# Altium project BLDC_DRV_F1.PrjPcb
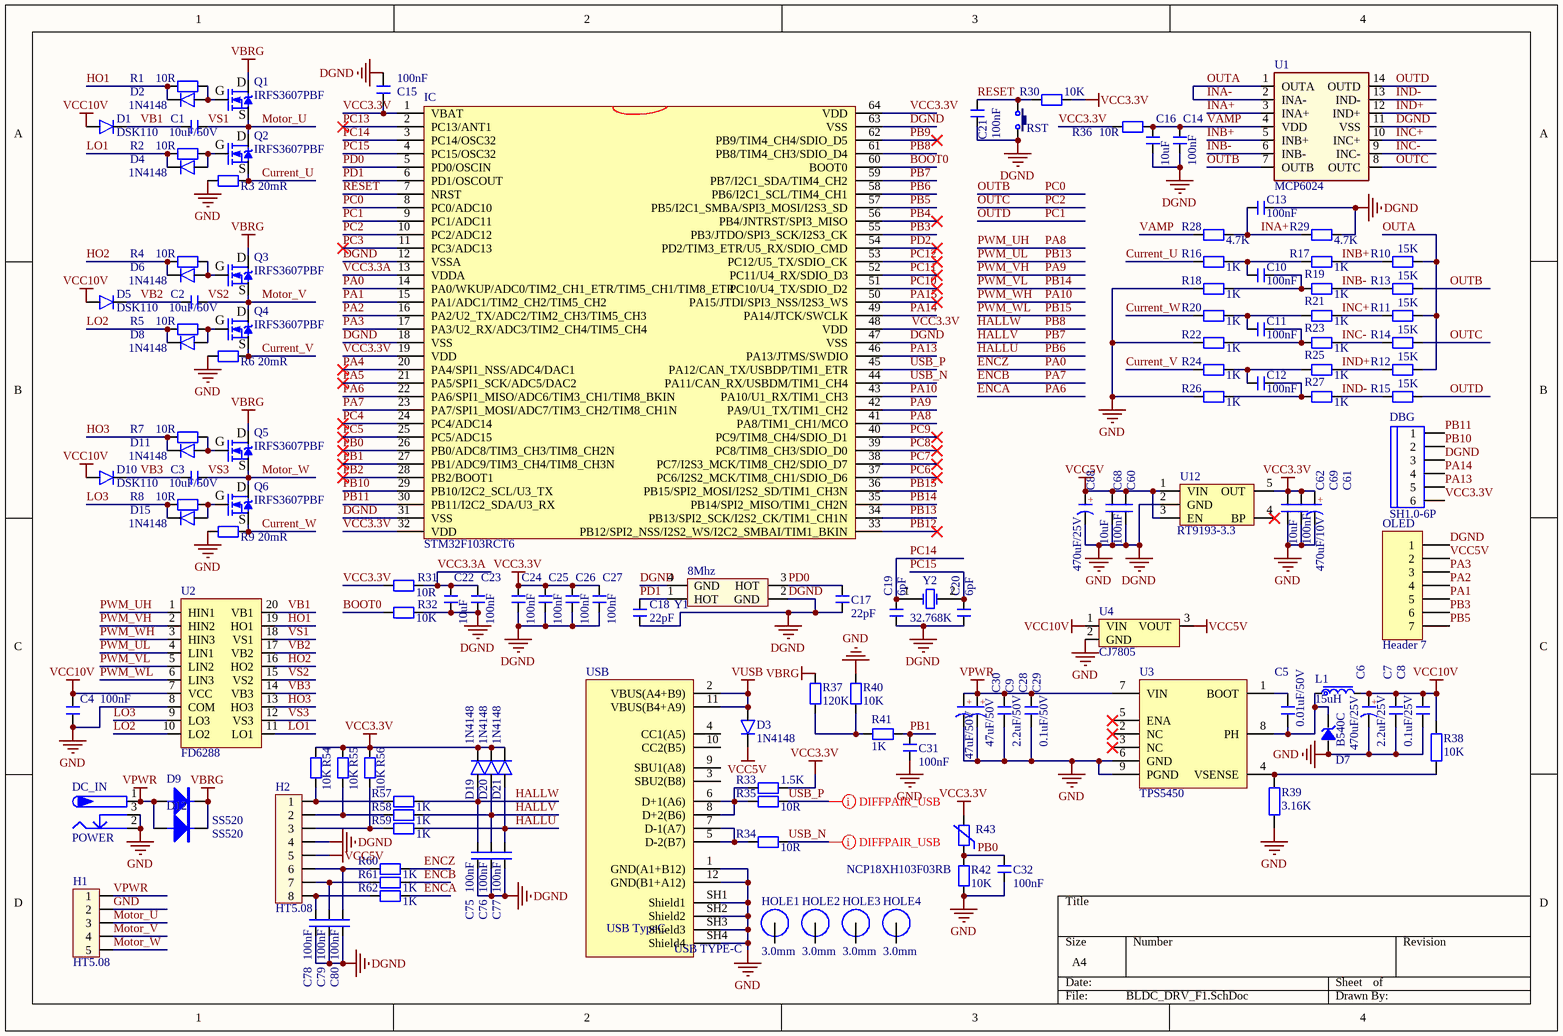
[diagram p0: BLDC_DRV_F1.SchDoc]
1 sheet, 138 parts. Net scope: global (net labels, ports and power ports of the same name join across sheets).
Board file: BLDC_DRV_F1.PcbDoc

## Sheet BLDC_DRV_F1.SchDoc
size A4

### Parts
C1  10uF/50V  [C 0603_L]
C2  10uF/50V  [C 0603_L]
C3  10uF/50V  [C 0603_L]
C4  100nF  [C 0603_L]
C5  0.01uF/50V  [C 0805_L]
C6  470uF/25V  [CM D(6.3*7.7)]
C7  2.2uF/25V  [C 0603_L]
C8  0.1uF/25V  [C 0603_L]
C9  47uF/50V  [CM D(6.3*7.7)]
C10  100nF  [C 0603_L]
C11  100nF  [C 0603_L]
C12  100nF  [C 0603_L]
C13  100nF  [C 0603_L]
C14  100nF  [C 0603_L]
C15  100nF  [C 0603_L]
C16  10uF  [C 0603_L]
C17  22pF  [C 0603_L]
C18  22pF  [C 0603_L]
C19  6pF  [C 0603_L]
C20  6pF  [C 0603_L]
C21  100nF  [C 0603_L]
C22  10uF  [C 0603_L]
C23  100nF  [C 0603_L]
C24  100nF  [C 0603_L]
C25  100nF  [C 0603_L]
C26  100nF  [C 0603_L]
C27  100nF  [C 0603_L]
C28  2.2uF/50V  [C 0805_L]
C29  0.1uF/50V  [C 0805_L]
C30  47uF/50V  [CM D(6.3*7.7)]
C31  100nF  [C 0603_L]
C32  100nF  [C 0603_L]
C60  100nF  [C 0603_L]
C61  470uF/10V  [CM D(6.3*7.7)]
C62  10uF  [C 0603_L]
C68  10uF  [C 0603_L]
C69  100nF  [C 0603_L]
C75  100nF  [C 0603_L]
C76  100nF  [C 0603_L]
C77  100nF  [C 0603_L]
C78  100nF  [C 0603_L]
C79  100nF  [C 0603_L]
C80  100nF  [C 0603_L]
C88  470uF/25V  [CM D(6.3*7.7)]
D1  DSK110  [SOD-323]
D2  1N4148  [SOD-323]
D3  1N4148  [SOD-323]
D4  1N4148  [SOD-323]
D5  DSK110  [SOD-323]
D6  1N4148  [SOD-323]
D7  B540C  [SMB]
D8  1N4148  [SOD-323]
D9  SS520  [SMC]
D10  DSK110  [SOD-323]
D11  1N4148  [SOD-323]
D12  SS520  [SMC]
D15  1N4148  [SOD-323]
D19  1N4148  [SOD-323]
D20  1N4148  [SOD-323]
D21  1N4148  [SOD-323]
DBG  SH1.0-6P  [SH1.0_6P]
DC_IN  POWER  [DC10B]
H1  HT5.08  [KF7620-5P]
H2  HT5.08  [SH1.0 S-W-8P]
HOLE1  value 3.0mm  [M3]  (hidden comment: HOLE)
HOLE2  value 3.0mm  [M3]  (hidden comment: HOLE)
HOLE3  value 3.0mm  [M3]  (hidden comment: HOLE)
HOLE4  value 3.0mm  [M3]  (hidden comment: HOLE)
IC  STM32F103RCT6  [LQFP64-10*10]
L1  15uH  [CDRH73]
OLED  Header 7  [HDR2.54-M-LI-7P]
Q1  IRFS3607PBF  [TO263-3B]
Q2  IRFS3607PBF  [TO263-3B]
Q3  IRFS3607PBF  [TO263-3B]
Q4  IRFS3607PBF  [TO263-3B]
Q5  IRFS3607PBF  [TO263-3B]
Q6  IRFS3607PBF  [TO263-3B]
R1  10R  [R 0603_L]
R2  10R  [R 0603_L]
R3  20mR  [R 2512_L]
R4  10R  [R 0603_L]
R5  10R  [R 0603_L]
R6  20mR  [R 2512_L]
R7  10R  [R 0603_L]
R8  10R  [R 0603_L]
R9  20mR  [R 2512_L]
R10  15K  [R 0603_L]
R11  15K  [R 0603_L]
R12  15K  [R 0603_L]
R13  15K  [R 0603_L]
R14  15K  [R 0603_L]
R15  15K  [R 0603_L]
R16  1K  [R 0603_L]
R17  1K  [R 0603_L]
R18  1K  [R 0603_L]
R19  1K  [R 0603_L]
R20  1K  [R 0603_L]
R21  1K  [R 0603_L]
R22  1K  [R 0603_L]
R23  1K  [R 0603_L]
R24  1K  [R 0603_L]
R25  1K  [R 0603_L]
R26  1K  [R 0603_L]
R27  1K  [R 0603_L]
R28  4.7K  [R 0603_L]
R29  4.7K  [R 0603_L]
R30  10K  [R 0603_L]
R31  10R  [R 0603_L]
R32  10K  [R 0603_L]
R33  1.5K  [R 0603_L]
R34  10R  [R 0603_L]
R35  10R  [R 0603_L]
R36  10R  [R 0603_L]
R37  120K  [R 0603_L]
R38  10K  [R 0603_L]
R39  3.16K  [R 0603_L]
R40  10K  [R 0603_L]
R41  1K  [R 0603_L]
R42  10K  [R 0603_L]
R43  NCP18XH103F03RB  [R 0603_L]
R54  10K  [R 0603_L]
R55  10K  [R 0603_L]
R56  10K  [R 0603_L]
R57  1K  [R 0603_L]
R58  1K  [R 0603_L]
R59  1K  [R 0603_L]
R60  1K  [R 0603_L]
R61  1K  [R 0603_L]
R62  1K  [R 0603_L]
RST  KEY  [TSW SMD-3*6*2.5]  (value not drawn)
U1  MCP6024  [SOP14_L]
U2  FD6288  [TSSOP20_L]
U3  TPS5450  [SOP8_G]
U4  CJ7805  [TO263_3B]
U12  RT9193-3.3  [SOT23-5L]
USB  USB TypeC  [USB Type-C]
Y1  8Mhz  [XTAL-3225]
Y2  32.768K  [OSC 3215-2P]

### Nets
DGND: C4.1 C6.2(K) C7.1 C8.1 C9.2(K) C13.2 C14.2 C15.2 C16.2 C17.1 C18.1 C19.1 C20.1 C21.2 C22.2 C23.2 C24.2 C25.2 C26.2 C27.2 C28.1 C29.1 C30.2(K) C31.1 C32.1 C60.2 C61.2(K) C62.2 C68.2 C69.2 C75.2 C76.2 C77.2 C78.2 C79.2 C80.2 C88.2(K) D7.1 DBG.3 DC_IN.2 DC_IN.3 H1.2 H2.4 IC.12(VSSA) IC.18(VSS) IC.31(VSS) IC.47(VSS) IC.63(VSS) OLED.1 R3.1 R6.1 R9.1 R18.1 R22.1 R26.1 R29.2 R32.2 R39.1 R40.2 R42.1 RST.2 U1.11(VSS) U2.8(COM) U3.6(GND) U3.9(PGND) U4.2(GND) U12.2(GND) USB.1(GND(A1+B12)) USB.12(GND(B1+A12)) USB.SH1(Shield1) USB.SH2(Shield2) USB.SH3(Shield3) USB.SH4(Shield4) Y1.2(GND) Y1.4(GND)  [also labelled GND]
VBRG: D9.2(K) D12.2(K) Q1.2(D) Q3.2(D) Q5.2(D) R37.2
VCC3.3V: C15.1 C24.1 C25.1 C26.1 C27.1 C61.1(A) C62.1 C69.1 D19.2 D20.2 D21.2 DBG.6 IC.1(VBAT) IC.19(VDD) IC.32(VDD) IC.48(VDD) IC.64(VDD) R30.2 R31.1 R33.2 R36.1 R43.2 R54.2 R55.2 R56.2 U12.5(OUT)
VCC5V: C60.1 C68.1 C88.1(A) D3.2 H2.5 OLED.2 U4.3(VOUT) U12.1(VIN) U12.3(EN)
VCC10V: C4.2 C6.1(A) C7.2 C8.2 D1.1 D5.1 D10.1 L1.2 R38.1 U2.7(VCC) U4.1(VIN)
VPWR: C9.1(A) C28.2 C29.2 C30.1(A) D9.1(A) D12.1(A) DC_IN.1 H1.1 U3.7(VIN)
VUSB: D3.1 USB.2(VBUS(A4+B9)) USB.11(VBUS(B4+A9))
BOOT0: IC.60(BOOT0) R32.1
Current_U: Q2.3(S) R3.2 R16.1
Current_V: Q4.3(S) R6.2 R24.1
Current_W: Q6.3(S) R9.2 R20.1
ENCA: IC.22(PA6/SPI1_MISO/ADC6/TIM3_CH1/TIM8_BKIN) R62.2  [also labelled PA6]
ENCB: IC.23(PA7/SPI1_MOSI/ADC7/TIM3_CH2/TIM8_CH1N) R61.2  [also labelled PA7]
ENCZ: IC.14(PA0/WKUP/ADC0/TIM2_CH1_ETR/TIM5_CH1/TIM8_ETR) R60.2  [also labelled PA0]
HALLU: C77.1 D21.1 IC.58(PB6/I2C1_SCL/TIM4_CH1) R59.2  [also labelled PB6]
HALLV: C76.1 D20.1 IC.59(PB7/I2C1_SDA/TIM4_CH2) R58.2  [also labelled PB7]
HALLW: C75.1 D19.1 IC.61(PB8/TIM4_CH3/SDIO_D4) R57.2  [also labelled PB8]
HO1: D2.2 R1.1 U2.19(HO1)
HO2: D6.2 R4.1 U2.16(HO2)
HO3: D11.2 R7.1 U2.13(HO3)
INA+: C13.1 R28.2 R29.1 U1.3(INA+)
INA-: R10.2 R11.2 R12.2 U1.1(OUTA) U1.2(INA-)  [also labelled OUTA]
INB+: R10.1 R17.2 U1.5(INB+)
INB-: R13.1 R19.2 U1.6(INB-)
INC+: R11.1 R21.2 U1.10(INC+)
INC-: R14.1 R23.2 U1.9(INC-)
IND+: R12.1 R25.2 U1.12(IND+)
IND-: R15.1 R27.2 U1.13(IND-)
LO1: D4.2 R2.1 U2.11(LO1)
LO2: D8.2 R5.1 U2.10(LO2)
LO3: D15.2 R8.1 U2.9(LO3)
Motor_U: C1.1 H1.3 Q1.3(S) Q2.2(D) U2.18(VS1)  [also labelled VS1]
Motor_V: C2.1 H1.4 Q3.3(S) Q4.2(D) U2.15(VS2)  [also labelled VS2]
Motor_W: C3.1 H1.5 Q5.3(S) Q6.2(D) U2.12(VS3)  [also labelled VS3]
OUTB: IC.8(PC0/ADC10) R13.2 U1.7(OUTB)  [also labelled PC0]
OUTC: IC.10(PC2/ADC12) R14.2 U1.8(OUTC)  [also labelled PC2]
OUTD: IC.9(PC1/ADC11) R15.2 U1.14(OUTD)  [also labelled PC1]
PA1: IC.15(PA1/ADC1/TIM2_CH2/TIM5_CH2) OLED.5
PA2: IC.16(PA2/U2_TX/ADC2/TIM2_CH3/TIM5_CH3) OLED.4
PA3: IC.17(PA3/U2_RX/ADC3/TIM2_CH4/TIM5_CH4) OLED.3
PA4: IC.20(PA4/SPI1_NSS/ADC4/DAC1)
PA5: IC.21(PA5/SPI1_SCK/ADC5/DAC2)
PA8: IC.41(PA8/TIM1_CH1/MCO) U2.1(HIN1)  [also labelled PWM_UH]
PA9: IC.42(PA9/U1_TX/TIM1_CH2) U2.2(HIN2)  [also labelled PWM_VH]
PA10: IC.43(PA10/U1_RX/TIM1_CH3) U2.3(HIN3)  [also labelled PWM_WH]
PA13: DBG.5 IC.46(PA13/JTMS/SWDIO)
PA14: DBG.4 IC.49(PA14/JTCK/SWCLK)
PA15: IC.50(PA15/JTDI/SPI3_NSS/I2S3_WS)
PB0: C32.2 IC.26(PB0/ADC8/TIM3_CH3/TIM8_CH2N) R42.2 R43.1
PB1: C31.2 IC.27(PB1/ADC9/TIM3_CH4/TIM8_CH3N) R41.1
PB2: IC.28(PB2/BOOT1)
PB3: IC.55(PB3/JTDO/SPI3_SCK/I2S3_CK) OLED.6
PB4: IC.56(PB4/JNTRST/SPI3_MISO)
PB5: IC.57(PB5/I2C1_SMBA/SPI3_MOSI/I2S3_SD) OLED.7
PB9: IC.62(PB9/TIM4_CH4/SDIO_D5)
PB10: DBG.2 IC.29(PB10/I2C2_SCL/U3_TX)
PB11: DBG.1 IC.30(PB11/I2C2_SDA/U3_RX)
PB12: IC.33(PB12/SPI2_NSS/I2S2_WS/I2C2_SMBAI/TIM1_BKIN)
PB13: IC.34(PB13/SPI2_SCK/I2S2_CK/TIM1_CH1N) U2.4(LIN1)  [also labelled PWM_UL]
PB14: IC.35(PB14/SPI2_MISO/TIM1_CH2N) U2.5(LIN2)  [also labelled PWM_VL]
PB15: IC.36(PB15/SPI2_MOSI/I2S2_SD/TIM1_CH3N) U2.6(LIN3)  [also labelled PWM_WL]
PC3: IC.11(PC3/ADC13)
PC4: IC.24(PC4/ADC14)
PC5: IC.25(PC5/ADC15)
PC6: IC.37(PC6/I2S2_MCK/TIM8_CH1/SDIO_D6)
PC7: IC.38(PC7/I2S3_MCK/TIM8_CH2/SDIO_D7)
PC8: IC.39(PC8/TIM8_CH3/SDIO_D0)
PC9: IC.40(PC9/TIM8_CH4/SDIO_D1)
PC10: IC.51(PC10/U4_TX/SDIO_D2)
PC11: IC.52(PC11/U4_RX/SDIO_D3)
PC12: IC.53(PC12/U5_TX/SDIO_CK)
PC13: IC.2(PC13/ANT1)
PC14: C19.2 IC.3(PC14/OSC32) Y2.1(OSC1)
PC15: C20.2 IC.4(PC15/OSC32) Y2.2(OSC2)
PD0: C17.2 IC.5(PD0/OSCIN) Y1.3(HOT)
PD1: C18.2 IC.6(PD1/OSCOUT) Y1.1(HOT)
PD2: IC.54(PD2/TIM3_ETR/U5_RX/SDIO_CMD)
RESET: C21.1 IC.7(NRST) R30.1 RST.1
USB_N: IC.44(PA11/CAN_RX/USBDM/TIM1_CH4) R34.2
USB_P: IC.45(PA12/CAN_TX/USBDP/TIM1_ETR) R35.2
VAMP: C14.1 C16.1 R28.1 R36.2 U1.4(VDD)
VB1: C1.2 D1.2 U2.20(VB1)
VB2: C2.2 D5.2 U2.17(VB2)
VB3: C3.2 D10.2 U2.14(VB3)
VCC3.3A: C22.1 C23.1 IC.13(VDDA) R31.2
NetC5_1: C5.1 D7.2 L1.1 U3.8(PH)
NetC5_2: C5.2 U3.1(BOOT)
NetC10_1: C10.1 R16.2 R17.1
NetC10_2: C10.2 R18.2 R19.1
NetC11_1: C11.1 R20.2 R21.1
NetC11_2: C11.2 R22.2 R23.1
NetC12_1: C12.1 R24.2 R25.1
NetC12_2: C12.2 R26.2 R27.1
NetC78_1: C78.1 H2.8 R62.1
NetC79_1: C79.1 H2.7 R61.1
NetC80_1: C80.1 H2.6 R60.1
NetD2_1: D2.1 Q1.1(G) R1.2
NetD4_1: D4.1 Q2.1(G) R2.2
NetD6_1: D6.1 Q3.1(G) R4.2
NetD8_1: D8.1 Q4.1(G) R5.2
NetD11_1: D11.1 Q5.1(G) R7.2
NetD15_1: D15.1 Q6.1(G) R8.2
NetH2_1: H2.1 R54.1 R57.1
NetH2_2: H2.2 R55.1 R58.1
NetH2_3: H2.3 R56.1 R59.1
NetR33_1: R33.1 R35.1 USB.6(D+1(A6)) USB.8(D+2(B6))
NetR34_1: R34.1 USB.5(D-2(B7)) USB.7(D-1(A7))
NetR37_1: R37.1 R40.1 R41.2
NetR38_2: R38.2 R39.2 U3.4(VSENSE)

Not connected (* = marked no-connect by the designer): HOLE1 1; HOLE2 1; HOLE3 1; HOLE4 1; U3 2(NC)* 3(NC)* 5(ENA)*; U12 4(BP)*; USB 3(SBU2(B8)) 4(CC1(A5)) 9(SBU1(A8)) 10(CC2(B5))

### Layout directives
differential pair: USB_N, USB_P

### Notes on the sheet
- (in symbol C-CM) +
- (in symbol USB 2.0 Type C) USB TYPE-C

### Library data of the parts
C1-C3 C5 C7 C8 C10-C14 C16-C29 C31 C32 C60 C62 C68 C69 C75-C80 = C: 无极性贴片电容
  C1-C3 C5 C7 C8 C10-C14 C16-C29 C31 C32 C75-C80: BOM名称: 无极性贴片电容
C4 C15 = C: 无极性贴片电容; 版权归属: 源创客; BOM名称: 无极性贴片电容; 学习资源: www.ooocke.com
C6 C9 C30 C61 C88 = C-CM: 贴片电解电容; BOM名称: 贴片电解电容
D1-D6 D8 D10 D11 D15 D19-D21 = D: 二极管
D7 = D-ZMM3V6: TVS二极管
D9 D12 = DIODE: 整流二极管
DBG = HEAD6
DC_IN = P-DC: 低压电源接口
H1 = Header_5P: 端子
H2 = Header_8P: 端子
HOLE1-HOLE4 = HOLE: 螺丝焊盘
IC = STM32F103RDT6
L1 = L-CDRH: 功率屏蔽电感; BOM名称: 功率屏蔽电感
OLED = Header 7: Header, 7-Pin; LatestRevisionDate: 17-Jul-2002; LatestRevisionNote: Re-released for DXP Platform.; Publisher: Altium Limited
Q1-Q6 = IRFS3607PBF: NMOS 75V+80A 7.4mΩ; BOM名称: N沟场效应管
R1-R42 R54-R62 = R: 贴片电阻
R43 = R_NTC: 热敏电阻
RST = KEY: 按键; BOM名称: 3x6轻触开关
U3 = TPS5450: 降压电源芯片
U4 = CJ7805: 7805 5V
U12 = LDO RT9193: LDO
USB = USB 2.0 Type C: 12P TypeC 母座
Y1 = XTAL_3225: 3225贴片无源晶振
Y2 = XTAL: Crystal Oscillator; Published: 8-Jun-2000; LatestRevisionDate: 17-Jul-2002; LatestRevisionNote: Re-released for DXP Platform.; Publisher: Altium Limited